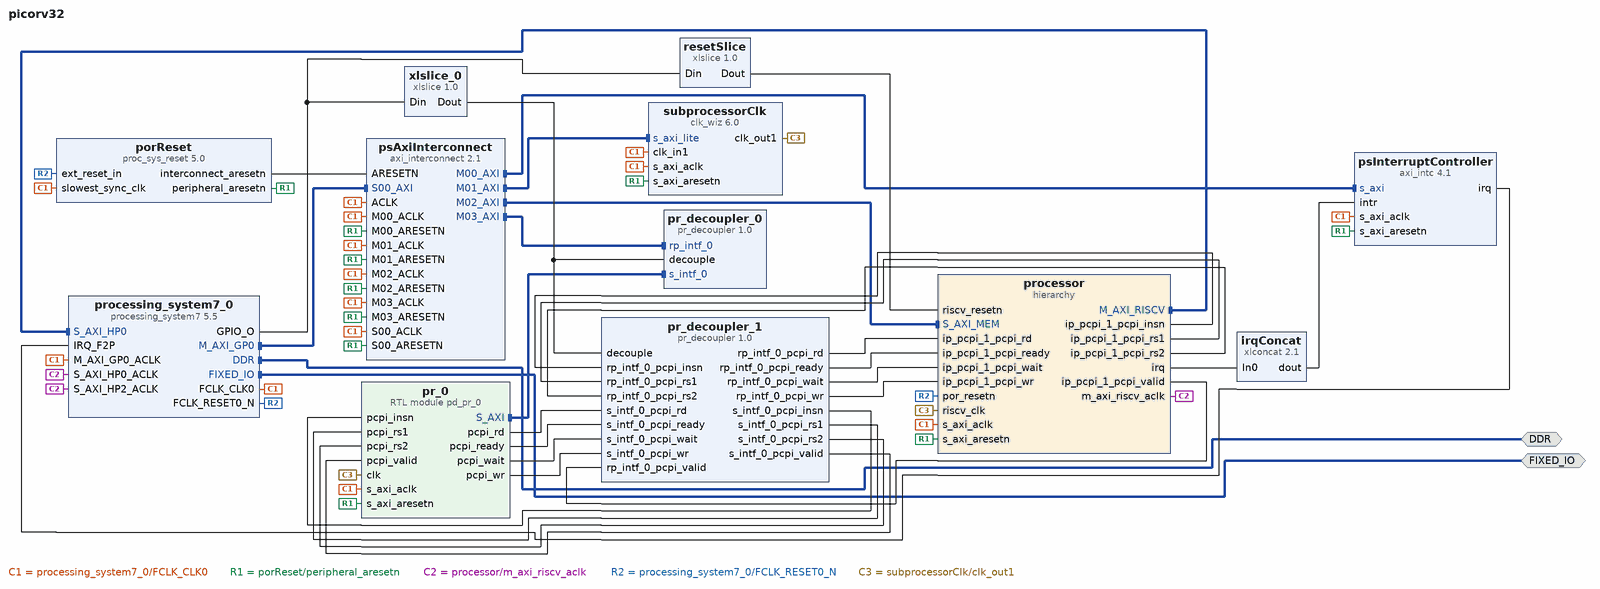
[diagram p0: block diagram of the top level]
# Vivado block design picorv32, xc7z020clg400-1, Vivado 2018.2
create_bd_design picorv32

create_bd_intf_port -mode Master -vlnv xilinx.com:interface:ddrx_rtl:1.0 DDR
create_bd_intf_port -mode Master -vlnv xilinx.com:display_processing_system7:fixedio_rtl:1.0 FIXED_IO

create_bd_cell -type ip -vlnv xilinx.com:ip:xlconcat:2.1 irqConcat
set_property -dict {CONFIG.NUM_PORTS 1} [get_bd_cells irqConcat]
create_bd_cell -type ip -vlnv xilinx.com:ip:proc_sys_reset:5.0 porReset
set_property -dict {CONFIG.C_AUX_RST_WIDTH 1 CONFIG.C_EXT_RST_WIDTH 1} [get_bd_cells porReset]
create_bd_cell -type ip -vlnv xilinx.com:ip:pr_decoupler:1.0 pr_decoupler_0
set_property -dict [list \
  CONFIG.ALL_PARAMS {INTF {intf_0 {ID 0 VLNV xilinx.com:interface:aximm_rtl:1.0 PROTOCOL axi4lite SIGNALS {ARVALID {PRESENT 1 WIDTH 1} ARREADY {PRESENT 1 WIDTH 1} AWVALID {PRESENT 1 WIDTH 1} AWREADY {PRESENT 1 WIDTH 1} BVALID {PRESENT 1 WIDTH 1} BREADY {PRESENT 1 WIDTH 1} RVALID {PRESENT 1 WIDTH 1} RREADY {PRESENT 1 WIDTH 1} WVALID {PRESENT 1 WIDTH 1} WREADY {PRESENT 1 WIDTH 1} AWADDR {PRESENT 1 WIDTH 32} AWLEN {PRESENT 0 WIDTH 8} AWSIZE {PRESENT 0 WIDTH 3} AWBURST {PRESENT 0 WIDTH 2} AWLOCK {PRESENT 0 WIDTH 1} AWCACHE {PRESENT 0 WIDTH 4} AWPROT {PRESENT 1 WIDTH 3} WDATA {PRESENT 1 WIDTH 32} WSTRB {PRESENT 1 WIDTH 4} WLAST {PRESENT 0 WIDTH 1} BRESP {PRESENT 1 WIDTH 2} ARADDR {PRESENT 1 WIDTH 32} ARLEN {PRESENT 0 WIDTH 8} ARSIZE {PRESENT 0 WIDTH 3} ARBURST {PRESENT 0 WIDTH 2} ARLOCK {PRESENT 0 WIDTH 1} ARCACHE {PRESENT 0 WIDTH 4} ARPROT {PRESENT 1 WIDTH 3} RDATA {PRESENT 1 WIDTH 32} RRESP {PRESENT 1 WIDTH 2} RLAST {PRESENT 0 WIDTH 1} AWID {PRESENT 0 WIDTH 0} AWREGION {PRESENT 1 WIDTH 4} AWQOS {PRESENT 1 WIDTH 4} AWUSER {PRESENT 0 WIDTH 0} WID {PRESENT 0 WIDTH 0} WUSER {PRESENT 0 WIDTH 0} BID {PRESENT 0 WIDTH 0} BUSER {PRESENT 0 WIDTH 0} ARID {PRESENT 0 WIDTH 0} ARREGION {PRESENT 1 WIDTH 4} ARQOS {PRESENT 1 WIDTH 4} ARUSER {PRESENT 0 WIDTH 0} RID {PRESENT 0 WIDTH 0} RUSER {PRESENT 0 WIDTH 0}}}} IPI_PROP_COUNT 5} \
  CONFIG.GUI_SELECT_INTERFACE 0 \
  CONFIG.GUI_INTERFACE_NAME intf_0 \
  CONFIG.GUI_SELECT_VLNV xilinx.com:interface:aximm_rtl:1.0 \
  CONFIG.GUI_INTERFACE_PROTOCOL axi4lite \
  CONFIG.GUI_SIGNAL_SELECT_0 ARVALID \
  CONFIG.GUI_SIGNAL_SELECT_1 ARREADY \
  CONFIG.GUI_SIGNAL_SELECT_2 AWVALID \
  CONFIG.GUI_SIGNAL_SELECT_3 AWREADY \
  CONFIG.GUI_SIGNAL_SELECT_4 BVALID \
  CONFIG.GUI_SIGNAL_SELECT_5 BREADY \
  CONFIG.GUI_SIGNAL_SELECT_6 RVALID \
  CONFIG.GUI_SIGNAL_SELECT_7 RREADY \
  CONFIG.GUI_SIGNAL_SELECT_8 WVALID \
  CONFIG.GUI_SIGNAL_SELECT_9 WREADY \
  CONFIG.GUI_SIGNAL_DECOUPLED_0 true \
  CONFIG.GUI_SIGNAL_DECOUPLED_1 true \
  CONFIG.GUI_SIGNAL_DECOUPLED_2 true \
  CONFIG.GUI_SIGNAL_DECOUPLED_3 true \
  CONFIG.GUI_SIGNAL_DECOUPLED_4 true \
  CONFIG.GUI_SIGNAL_DECOUPLED_5 true \
  CONFIG.GUI_SIGNAL_DECOUPLED_6 true \
  CONFIG.GUI_SIGNAL_DECOUPLED_7 true \
  CONFIG.GUI_SIGNAL_DECOUPLED_8 true \
  CONFIG.GUI_SIGNAL_DECOUPLED_9 true \
] [get_bd_cells pr_decoupler_0]
create_bd_cell -type ip -vlnv xilinx.com:ip:pr_decoupler:1.0 pr_decoupler_1
set_property -dict [list \
  CONFIG.ALL_PARAMS {INTF {intf_0 {ID 0 VLNV cliffordwolf:ip:pcpi_rtl:1.0 SIGNALS {pcpi_rs1 {PRESENT 1} pcpi_rs2 {PRESENT 1} pcpi_insn {PRESENT 1} pcpi_valid {PRESENT 1} pcpi_rd {PRESENT 1 WIDTH 32} pcpi_wr {PRESENT 1 WIDTH 1} pcpi_ready {PRESENT 1 WIDTH 1} pcpi_wait {PRESENT 1 WIDTH 1}}}} IPI_PROP_COUNT 0} \
  CONFIG.GUI_SELECT_INTERFACE 0 \
  CONFIG.GUI_INTERFACE_NAME intf_0 \
  CONFIG.GUI_SELECT_VLNV cliffordwolf:ip:pcpi_rtl:1.0 \
  CONFIG.GUI_SIGNAL_SELECT_0 pcpi_rs1 \
  CONFIG.GUI_SIGNAL_SELECT_1 pcpi_rs2 \
  CONFIG.GUI_SIGNAL_SELECT_2 pcpi_insn \
  CONFIG.GUI_SIGNAL_SELECT_3 pcpi_valid \
  CONFIG.GUI_SIGNAL_SELECT_4 pcpi_rd \
  CONFIG.GUI_SIGNAL_SELECT_5 pcpi_wr \
  CONFIG.GUI_SIGNAL_SELECT_6 pcpi_ready \
  CONFIG.GUI_SIGNAL_SELECT_7 pcpi_wait \
  CONFIG.GUI_SIGNAL_DECOUPLED_0 true \
  CONFIG.GUI_SIGNAL_DECOUPLED_1 true \
  CONFIG.GUI_SIGNAL_DECOUPLED_2 true \
  CONFIG.GUI_SIGNAL_DECOUPLED_3 true \
  CONFIG.GUI_SIGNAL_DECOUPLED_4 true \
  CONFIG.GUI_SIGNAL_DECOUPLED_5 true \
  CONFIG.GUI_SIGNAL_DECOUPLED_6 true \
  CONFIG.GUI_SIGNAL_DECOUPLED_7 true \
] [get_bd_cells pr_decoupler_1]
create_bd_cell -type ip -vlnv xilinx.com:ip:processing_system7:5.5 processing_system7_0
set_property -dict [list \
  CONFIG.PCW_UIPARAM_DDR_FREQ_MHZ 525 \
  CONFIG.PCW_CRYSTAL_PERIPHERAL_FREQMHZ 50 \
  CONFIG.PCW_APU_PERIPHERAL_FREQMHZ 650 \
  CONFIG.PCW_SDIO_PERIPHERAL_FREQMHZ 50 \
  CONFIG.PCW_UART_PERIPHERAL_FREQMHZ 100 \
  CONFIG.PCW_FPGA0_PERIPHERAL_FREQMHZ 50 \
  CONFIG.PCW_FPGA1_PERIPHERAL_FREQMHZ 50 \
  CONFIG.PCW_FPGA2_PERIPHERAL_FREQMHZ 100 \
  CONFIG.PCW_FPGA3_PERIPHERAL_FREQMHZ 160 \
  CONFIG.PCW_USE_S_AXI_HP0 1 \
  CONFIG.PCW_USE_S_AXI_HP2 1 \
  CONFIG.PCW_USE_FABRIC_INTERRUPT 1 \
  CONFIG.PCW_GPIO_EMIO_GPIO_WIDTH 7 \
  CONFIG.PCW_IRQ_F2P_INTR 1 \
  CONFIG.PCW_PERIPHERAL_BOARD_PRESET None \
  CONFIG.PCW_PRESET_BANK1_VOLTAGE {LVCMOS 1.8V} \
  CONFIG.PCW_UIPARAM_DDR_BUS_WIDTH {16 Bit} \
  CONFIG.PCW_UIPARAM_DDR_PARTNO Custom \
  CONFIG.PCW_QSPI_PERIPHERAL_ENABLE 1 \
  CONFIG.PCW_QSPI_QSPI_IO {MIO 1 .. 6} \
  CONFIG.PCW_QSPI_GRP_SINGLE_SS_ENABLE 1 \
  CONFIG.PCW_QSPI_GRP_SINGLE_SS_IO {MIO 1 .. 6} \
  CONFIG.PCW_SINGLE_QSPI_DATA_MODE x4 \
  CONFIG.PCW_QSPI_GRP_FBCLK_ENABLE 1 \
  CONFIG.PCW_QSPI_GRP_FBCLK_IO {MIO 8} \
  CONFIG.PCW_ENET0_PERIPHERAL_ENABLE 1 \
  CONFIG.PCW_ENET0_ENET0_IO {MIO 16 .. 27} \
  CONFIG.PCW_ENET0_GRP_MDIO_ENABLE 1 \
  CONFIG.PCW_ENET0_GRP_MDIO_IO {MIO 52 .. 53} \
  CONFIG.PCW_SD0_PERIPHERAL_ENABLE 1 \
  CONFIG.PCW_SD0_SD0_IO {MIO 40 .. 45} \
  CONFIG.PCW_SD0_GRP_CD_ENABLE 1 \
  CONFIG.PCW_SD0_GRP_CD_IO {MIO 47} \
  CONFIG.PCW_SD0_GRP_WP_ENABLE 0 \
  CONFIG.PCW_UART0_PERIPHERAL_ENABLE 1 \
  CONFIG.PCW_UART0_UART0_IO {MIO 14 .. 15} \
  CONFIG.PCW_UART1_PERIPHERAL_ENABLE 0 \
  CONFIG.PCW_USB0_PERIPHERAL_ENABLE 1 \
  CONFIG.PCW_USB0_USB0_IO {MIO 28 .. 39} \
  CONFIG.PCW_GPIO_MIO_GPIO_ENABLE 0 \
  CONFIG.PCW_GPIO_EMIO_GPIO_ENABLE 1 \
  CONFIG.PCW_GPIO_EMIO_GPIO_IO 7 \
] [get_bd_cells processing_system7_0]
# 475 more settings of processing_system7_0 are not shown: defaults, MIO pin electricals, DDR timing, and values the tool derives
create_bd_cell -type hier processor
create_bd_cell -type ip -vlnv xilinx.com:ip:axi_interconnect:2.1 psAxiInterconnect
set_property -dict {CONFIG.NUM_MI 4} [get_bd_cells psAxiInterconnect]
create_bd_cell -type ip -vlnv xilinx.com:ip:axi_intc:4.1 psInterruptController
create_bd_cell -type ip -vlnv xilinx.com:ip:xlslice:1.0 resetSlice
set_property -dict {CONFIG.DIN_TO 0 CONFIG.DIN_FROM 0 CONFIG.DIN_WIDTH 7} [get_bd_cells resetSlice]
create_bd_cell -type ip -vlnv xilinx.com:ip:clk_wiz:6.0 subprocessorClk
set_property -dict [list \
  CONFIG.USE_PHASE_ALIGNMENT false \
  CONFIG.USE_DYN_RECONFIG true \
  CONFIG.SECONDARY_SOURCE Single_ended_clock_capable_pin \
  CONFIG.CLKIN1_JITTER_PS 200.0 \
  CONFIG.CLKOUT1_REQUESTED_OUT_FREQ 50 \
  CONFIG.CLKOUT1_DRIVES BUFG \
  CONFIG.CLKOUT2_DRIVES BUFG \
  CONFIG.CLKOUT3_DRIVES BUFG \
  CONFIG.CLKOUT4_DRIVES BUFG \
  CONFIG.CLKOUT5_DRIVES BUFG \
  CONFIG.CLKOUT6_DRIVES BUFG \
  CONFIG.CLKOUT7_DRIVES BUFG \
  CONFIG.USE_LOCKED true \
  CONFIG.RESET_PORT reset \
  CONFIG.MMCM_DIVCLK_DIVIDE 1 \
  CONFIG.MMCM_CLKFBOUT_MULT_F 20.000 \
  CONFIG.MMCM_CLKIN1_PERIOD 20.000 \
  CONFIG.MMCM_CLKIN2_PERIOD 10.0 \
  CONFIG.MMCM_CLKOUT0_DIVIDE_F 20.000 \
  CONFIG.RESET_TYPE ACTIVE_HIGH \
  CONFIG.CLKOUT1_JITTER 192.113 \
  CONFIG.CLKOUT1_PHASE_ERROR 164.985 \
] [get_bd_cells subprocessorClk]
create_bd_cell -type ip -vlnv xilinx.com:ip:xlslice:1.0 xlslice_0
set_property -dict {CONFIG.DIN_TO 1 CONFIG.DIN_FROM 1 CONFIG.DIN_WIDTH 7 CONFIG.DOUT_WIDTH 1} [get_bd_cells xlslice_0]
create_bd_cell -type module -reference pd_pr_0 pr_0

# ---- hierarchy /processor ----
current_bd_instance /processor
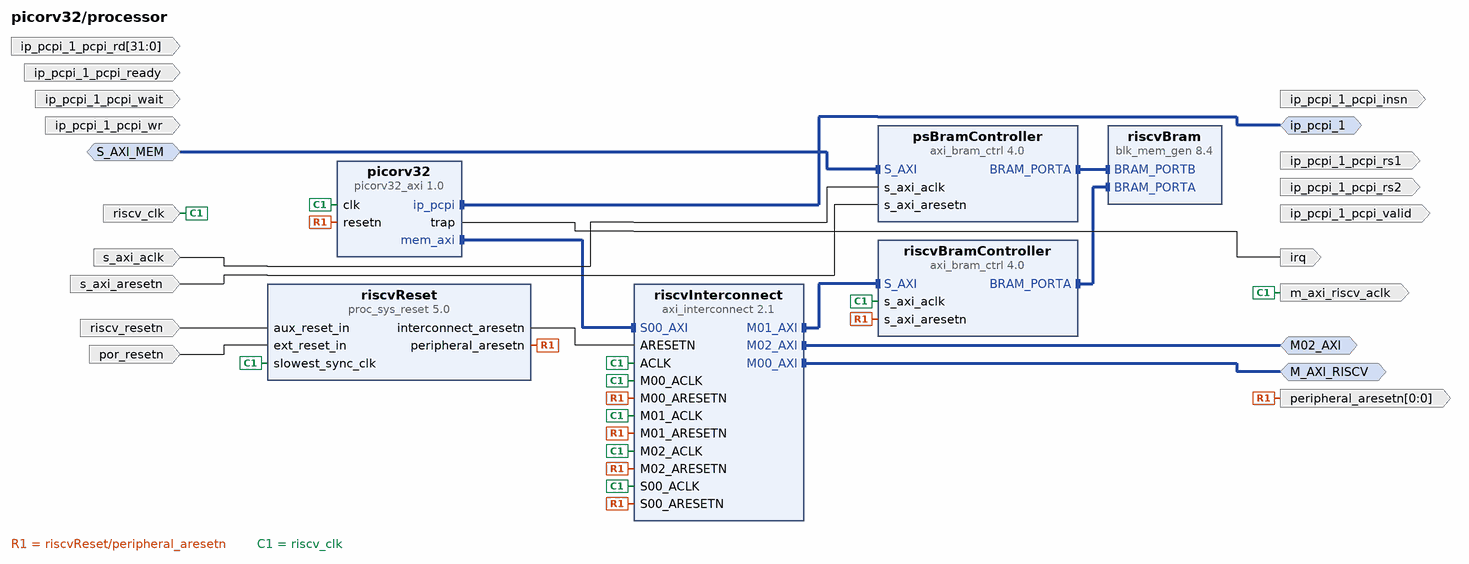
[diagram p1: block diagram inside /processor]
create_bd_intf_pin -mode Master -vlnv xilinx.com:interface:aximm_rtl:1.0 M02_AXI
create_bd_intf_pin -mode Master -vlnv xilinx.com:interface:aximm_rtl:1.0 M_AXI_RISCV
create_bd_intf_pin -mode Slave -vlnv xilinx.com:interface:aximm_rtl:1.0 S_AXI_MEM
create_bd_intf_pin -mode Master -vlnv cliffordwolf:ip:pcpi_rtl:1.0 ip_pcpi_1
create_bd_pin -dir O irq
create_bd_pin -dir O m_axi_riscv_aclk
create_bd_pin -dir O -from 0 -to 0 -type rst peripheral_aresetn
create_bd_pin -dir I -type rst por_resetn
create_bd_pin -dir I -type clk riscv_clk
create_bd_pin -dir I -type rst riscv_resetn
create_bd_pin -dir I -type clk s_axi_aclk
create_bd_pin -dir I -type rst s_axi_aresetn
create_bd_pin -dir O ip_pcpi_1_pcpi_rs1
create_bd_pin -dir O ip_pcpi_1_pcpi_rs2
create_bd_pin -dir O ip_pcpi_1_pcpi_insn
create_bd_pin -dir O ip_pcpi_1_pcpi_valid
create_bd_pin -dir I -from 31 -to 0 ip_pcpi_1_pcpi_rd
create_bd_pin -dir I ip_pcpi_1_pcpi_wr
create_bd_pin -dir I ip_pcpi_1_pcpi_ready
create_bd_pin -dir I ip_pcpi_1_pcpi_wait

create_bd_cell -type ip -vlnv cliffordwolf:ip:picorv32_axi:1.0 picorv32
set_property -dict [list \
  CONFIG.ENABLE_COUNTERS true \
  CONFIG.ENABLE_COUNTERS64 false \
  CONFIG.ENABLE_REGS_16_31 true \
  CONFIG.ENABLE_REGS_DUALPORT true \
  CONFIG.CATCH_MISALIGN false \
  CONFIG.CATCH_ILLINSN false \
  CONFIG.ENABLE_PCPI true \
  CONFIG.ENABLE_FAST_MUL true \
  CONFIG.ENABLE_DIV true \
  CONFIG.ENABLE_IRQ_QREGS false \
  CONFIG.ENABLE_IRQ_TIMER false \
  CONFIG.STACKADDR 0x00000000 \
] [get_bd_cells picorv32]
create_bd_cell -type ip -vlnv xilinx.com:ip:axi_bram_ctrl:4.0 psBramController
set_property -dict {CONFIG.PROTOCOL AXI4 CONFIG.SINGLE_PORT_BRAM 1} [get_bd_cells psBramController]
create_bd_cell -type ip -vlnv xilinx.com:ip:blk_mem_gen:8.4 riscvBram
set_property -dict [list \
  CONFIG.Memory_Type True_Dual_Port_RAM \
  CONFIG.Enable_32bit_Address true \
  CONFIG.Assume_Synchronous_Clk false \
  CONFIG.Enable_B Use_ENB_Pin \
  CONFIG.Register_PortA_Output_of_Memory_Primitives false \
  CONFIG.Register_PortB_Output_of_Memory_Primitives false \
  CONFIG.Use_RSTA_Pin true \
  CONFIG.Use_RSTB_Pin true \
  CONFIG.Port_B_Clock 100 \
  CONFIG.Port_B_Write_Rate 50 \
  CONFIG.Port_B_Enable_Rate 100 \
  CONFIG.use_bram_block BRAM_Controller \
  CONFIG.EN_SAFETY_CKT false \
] [get_bd_cells riscvBram]
create_bd_cell -type ip -vlnv xilinx.com:ip:axi_bram_ctrl:4.0 riscvBramController
set_property -dict {CONFIG.PROTOCOL AXI4LITE CONFIG.SINGLE_PORT_BRAM 1} [get_bd_cells riscvBramController]
create_bd_cell -type ip -vlnv xilinx.com:ip:axi_interconnect:2.1 riscvInterconnect
set_property -dict {CONFIG.NUM_MI 3} [get_bd_cells riscvInterconnect]
create_bd_cell -type ip -vlnv xilinx.com:ip:proc_sys_reset:5.0 riscvReset
set_property -dict {CONFIG.C_AUX_RST_WIDTH 1 CONFIG.C_EXT_RST_WIDTH 1} [get_bd_cells riscvReset]

# ---- connections ----

current_bd_instance /processor
connect_bd_intf_net -intf_net axi_interconnect_0_M01_AXI [get_bd_intf_pins riscvBramController/S_AXI] [get_bd_intf_pins riscvInterconnect/M01_AXI]
connect_bd_intf_net [get_bd_intf_pins picorv32/mem_axi] [get_bd_intf_pins riscvInterconnect/S00_AXI]
connect_bd_intf_net [get_bd_intf_pins psBramController/BRAM_PORTA] [get_bd_intf_pins riscvBram/BRAM_PORTB]
connect_bd_intf_net [get_bd_intf_pins riscvBram/BRAM_PORTA] [get_bd_intf_pins riscvBramController/BRAM_PORTA]
connect_bd_intf_net [get_bd_intf_pins M02_AXI] [get_bd_intf_pins riscvInterconnect/M02_AXI]
connect_bd_intf_net [get_bd_intf_pins M_AXI_RISCV] [get_bd_intf_pins riscvInterconnect/M00_AXI]
connect_bd_intf_net [get_bd_intf_pins S_AXI_MEM] [get_bd_intf_pins psBramController/S_AXI]
connect_bd_intf_net [get_bd_intf_pins ip_pcpi_1] [get_bd_intf_pins picorv32/ip_pcpi]
connect_bd_net -net ARESETN_1 [get_bd_pins riscvReset/interconnect_aresetn] [get_bd_pins riscvInterconnect/ARESETN]
connect_bd_net -net aux_reset_in_1 [get_bd_pins riscv_resetn] [get_bd_pins riscvReset/aux_reset_in]
connect_bd_net -net clk_in1_1 [get_bd_pins s_axi_aclk] [get_bd_pins psBramController/s_axi_aclk]
connect_bd_net -net ext_reset_in_1 [get_bd_pins por_resetn] [get_bd_pins riscvReset/ext_reset_in]
connect_bd_net [get_bd_pins picorv32/trap] [get_bd_pins irq]
connect_bd_net [get_bd_pins riscvReset/peripheral_aresetn] \
  [get_bd_pins peripheral_aresetn] [get_bd_pins picorv32/resetn] [get_bd_pins riscvBramController/s_axi_aresetn] \
  [get_bd_pins riscvInterconnect/M00_ARESETN] [get_bd_pins riscvInterconnect/M01_ARESETN] \
  [get_bd_pins riscvInterconnect/M02_ARESETN] [get_bd_pins riscvInterconnect/S00_ARESETN]
connect_bd_net [get_bd_pins s_axi_aresetn] [get_bd_pins psBramController/s_axi_aresetn]
connect_bd_net -net subprocessorClk [get_bd_pins riscv_clk] \
  [get_bd_pins m_axi_riscv_aclk] [get_bd_pins picorv32/clk] [get_bd_pins riscvBramController/s_axi_aclk] \
  [get_bd_pins riscvReset/slowest_sync_clk] [get_bd_pins riscvInterconnect/ACLK] [get_bd_pins riscvInterconnect/M00_ACLK] \
  [get_bd_pins riscvInterconnect/M01_ACLK] [get_bd_pins riscvInterconnect/M02_ACLK] [get_bd_pins riscvInterconnect/S00_ACLK]

current_bd_instance /
connect_bd_intf_net [get_bd_intf_pins pr_0/S_AXI] [get_bd_intf_pins pr_decoupler_0/s_intf_0]
connect_bd_intf_net [get_bd_intf_pins processor/S_AXI_MEM] [get_bd_intf_pins psAxiInterconnect/M02_AXI]
connect_bd_intf_net -intf_net S_AXI_PSX [get_bd_intf_pins processing_system7_0/M_AXI_GP0] [get_bd_intf_pins psAxiInterconnect/S00_AXI]
connect_bd_intf_net [get_bd_intf_pins processing_system7_0/S_AXI_HP0] [get_bd_intf_pins processor/M_AXI_RISCV]
connect_bd_intf_net [get_bd_intf_pins psAxiInterconnect/M00_AXI] [get_bd_intf_pins psInterruptController/s_axi]
connect_bd_intf_net [get_bd_intf_pins psAxiInterconnect/M01_AXI] [get_bd_intf_pins subprocessorClk/s_axi_lite]
connect_bd_intf_net [get_bd_intf_pins pr_decoupler_0/rp_intf_0] [get_bd_intf_pins psAxiInterconnect/M03_AXI]
connect_bd_intf_net [get_bd_intf_ports DDR] [get_bd_intf_pins processing_system7_0/DDR]
connect_bd_intf_net [get_bd_intf_ports FIXED_IO] [get_bd_intf_pins processing_system7_0/FIXED_IO]
connect_bd_net -net FCLK_CLK0 [get_bd_pins processing_system7_0/FCLK_CLK0] \
  [get_bd_pins porReset/slowest_sync_clk] [get_bd_pins processing_system7_0/M_AXI_GP0_ACLK] \
  [get_bd_pins psInterruptController/s_axi_aclk] [get_bd_pins subprocessorClk/clk_in1] \
  [get_bd_pins subprocessorClk/s_axi_aclk] [get_bd_pins processor/s_axi_aclk] [get_bd_pins psAxiInterconnect/ACLK] \
  [get_bd_pins psAxiInterconnect/M00_ACLK] [get_bd_pins psAxiInterconnect/M01_ACLK] [get_bd_pins psAxiInterconnect/M02_ACLK] \
  [get_bd_pins psAxiInterconnect/M03_ACLK] [get_bd_pins psAxiInterconnect/S00_ACLK] [get_bd_pins pr_0/s_axi_aclk]
connect_bd_net -net S00_ARESETN_1 [get_bd_pins porReset/peripheral_aresetn] \
  [get_bd_pins psInterruptController/s_axi_aresetn] [get_bd_pins subprocessorClk/s_axi_aresetn] \
  [get_bd_pins processor/s_axi_aresetn] [get_bd_pins psAxiInterconnect/M00_ARESETN] \
  [get_bd_pins psAxiInterconnect/M01_ARESETN] [get_bd_pins psAxiInterconnect/M02_ARESETN] \
  [get_bd_pins psAxiInterconnect/M03_ARESETN] [get_bd_pins psAxiInterconnect/S00_ARESETN] [get_bd_pins pr_0/s_axi_aresetn]
connect_bd_net -net ip_pcpi_1_pcpi_rd_1 [get_bd_pins pr_decoupler_1/rp_intf_0_pcpi_rd] [get_bd_pins processor/ip_pcpi_1_pcpi_rd]
connect_bd_net -net irq [get_bd_pins processor/irq] [get_bd_pins irqConcat/In0]
connect_bd_net -net m_axi_riscv_aclk [get_bd_pins processor/m_axi_riscv_aclk] \
  [get_bd_pins processing_system7_0/S_AXI_HP0_ACLK] [get_bd_pins processing_system7_0/S_AXI_HP2_ACLK]
connect_bd_net -net pcpi_insn_1 [get_bd_pins pr_decoupler_1/s_intf_0_pcpi_insn] [get_bd_pins pr_0/pcpi_insn]
connect_bd_net -net pcpi_rs1_1 [get_bd_pins pr_decoupler_1/s_intf_0_pcpi_rs1] [get_bd_pins pr_0/pcpi_rs1]
connect_bd_net -net pcpi_rs2_1 [get_bd_pins pr_decoupler_1/s_intf_0_pcpi_rs2] [get_bd_pins pr_0/pcpi_rs2]
connect_bd_net -net pcpi_valid_1 [get_bd_pins pr_decoupler_1/s_intf_0_pcpi_valid] [get_bd_pins pr_0/pcpi_valid]
connect_bd_net [get_bd_pins porReset/interconnect_aresetn] [get_bd_pins psAxiInterconnect/ARESETN]
connect_bd_net -net por_resetn [get_bd_pins processing_system7_0/FCLK_RESET0_N] [get_bd_pins porReset/ext_reset_in] [get_bd_pins processor/por_resetn]
connect_bd_net [get_bd_pins pr_0/pcpi_rd] [get_bd_pins pr_decoupler_1/s_intf_0_pcpi_rd]
connect_bd_net [get_bd_pins pr_0/pcpi_ready] [get_bd_pins pr_decoupler_1/s_intf_0_pcpi_ready]
connect_bd_net [get_bd_pins pr_0/pcpi_wait] [get_bd_pins pr_decoupler_1/s_intf_0_pcpi_wait]
connect_bd_net [get_bd_pins pr_0/pcpi_wr] [get_bd_pins pr_decoupler_1/s_intf_0_pcpi_wr]
connect_bd_net [get_bd_pins pr_decoupler_1/rp_intf_0_pcpi_ready] [get_bd_pins processor/ip_pcpi_1_pcpi_ready]
connect_bd_net [get_bd_pins pr_decoupler_1/rp_intf_0_pcpi_wait] [get_bd_pins processor/ip_pcpi_1_pcpi_wait]
connect_bd_net [get_bd_pins pr_decoupler_1/rp_intf_0_pcpi_wr] [get_bd_pins processor/ip_pcpi_1_pcpi_wr]
connect_bd_net [get_bd_pins processing_system7_0/GPIO_O] [get_bd_pins resetSlice/Din] [get_bd_pins xlslice_0/Din]
connect_bd_net [get_bd_pins processor/ip_pcpi_1_pcpi_insn] [get_bd_pins pr_decoupler_1/rp_intf_0_pcpi_insn]
connect_bd_net [get_bd_pins processor/ip_pcpi_1_pcpi_rs1] [get_bd_pins pr_decoupler_1/rp_intf_0_pcpi_rs1]
connect_bd_net [get_bd_pins processor/ip_pcpi_1_pcpi_rs2] [get_bd_pins pr_decoupler_1/rp_intf_0_pcpi_rs2]
connect_bd_net [get_bd_pins processor/ip_pcpi_1_pcpi_valid] [get_bd_pins pr_decoupler_1/rp_intf_0_pcpi_valid]
connect_bd_net -net psirq [get_bd_pins psInterruptController/irq] [get_bd_pins processing_system7_0/IRQ_F2P]
connect_bd_net -net riscv_resetn [get_bd_pins resetSlice/Dout] [get_bd_pins processor/riscv_resetn]
connect_bd_net [get_bd_pins subprocessorClk/clk_out1] [get_bd_pins processor/riscv_clk] [get_bd_pins pr_0/clk]
connect_bd_net -net xlconcat_0_dout [get_bd_pins irqConcat/dout] [get_bd_pins psInterruptController/intr]
connect_bd_net [get_bd_pins xlslice_0/Dout] [get_bd_pins pr_decoupler_0/decouple] [get_bd_pins pr_decoupler_1/decouple]

# ---- address map ----
assign_bd_address -offset 0x40000000 -range 256K -target_address_space [get_bd_addr_spaces processing_system7_0/Data] [get_bd_addr_segs processor/psBramController/S_AXI/Mem0]
assign_bd_address -offset 0x40040000 -range 64K -target_address_space [get_bd_addr_spaces processing_system7_0/Data] [get_bd_addr_segs psInterruptController/S_AXI/Reg]
assign_bd_address -offset 0x41200000 -range 64K -target_address_space [get_bd_addr_spaces processing_system7_0/Data] [get_bd_addr_segs pr_0/S_AXI/Reg0]
assign_bd_address -offset 0x43C00000 -range 64K -target_address_space [get_bd_addr_spaces processing_system7_0/Data] [get_bd_addr_segs subprocessorClk/s_axi_lite/Reg]
assign_bd_address -offset 0x00000000 -range 256K -target_address_space [get_bd_addr_spaces processor/picorv32/mem_axi] [get_bd_addr_segs processor/riscvBramController/S_AXI/Mem0]
assign_bd_address -offset 0x10000000 -range 256M -target_address_space [get_bd_addr_spaces processor/picorv32/mem_axi] [get_bd_addr_segs processing_system7_0/S_AXI_HP0/HP0_DDR_LOWOCM]

validate_bd_design
save_bd_design
